# Altium schematic sheet Sensing.SchDoc: fNIRS - Sensing
size A3; CompanyName: UofT Capstone Team 2024991; DrawnBy: Tony Kim; Revision: 1; SheetNumber: 8; SheetTotal: 13
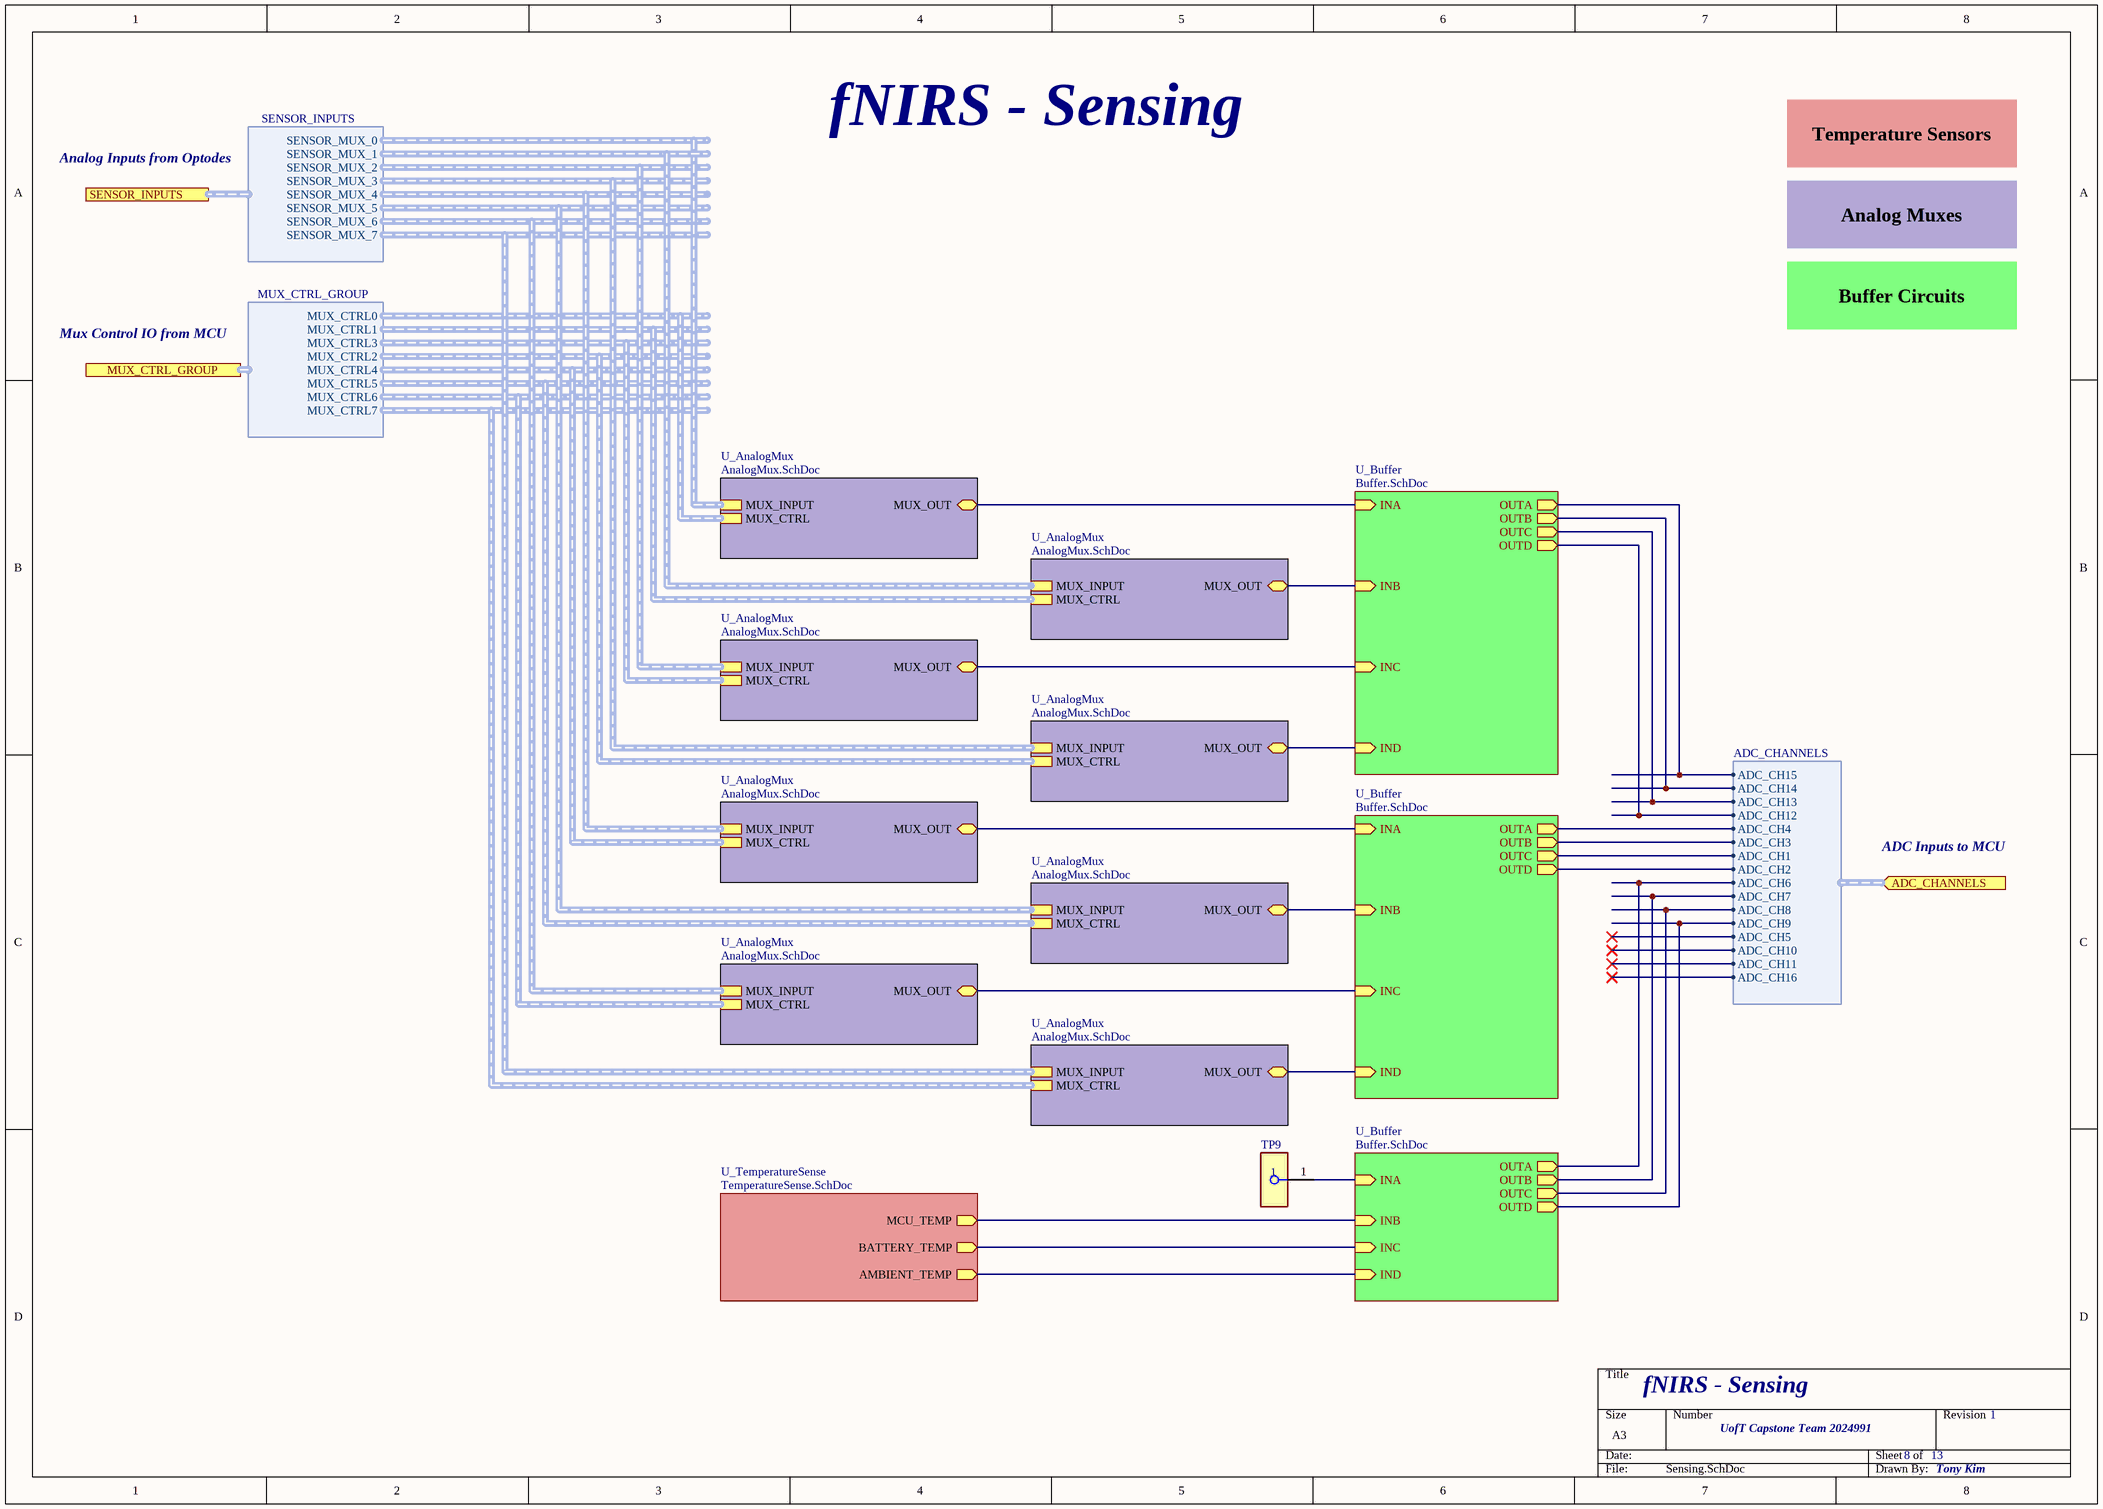
[diagram p0: Sensing.SchDoc]

## Parts
TP9  S2761-46R  [FP-S2761-46R-MFG]  (value not drawn)

## Sub-sheets
U_AnalogMux = AnalogMux.SchDoc: MUX_INPUT (harness SENSOR_INPUT), MUX_CTRL (harness MUX_CTRL), MUX_OUT (bidir)
U_AnalogMux = AnalogMux.SchDoc: MUX_INPUT (harness SENSOR_INPUT), MUX_CTRL (harness MUX_CTRL), MUX_OUT (bidir)
U_AnalogMux = AnalogMux.SchDoc: MUX_INPUT (harness SENSOR_INPUT), MUX_CTRL (harness MUX_CTRL), MUX_OUT (bidir)
U_AnalogMux = AnalogMux.SchDoc: MUX_INPUT (harness SENSOR_INPUT), MUX_CTRL (harness MUX_CTRL), MUX_OUT (bidir)
U_AnalogMux = AnalogMux.SchDoc: MUX_INPUT (harness SENSOR_INPUT), MUX_CTRL (harness MUX_CTRL), MUX_OUT (bidir)
U_AnalogMux = AnalogMux.SchDoc: MUX_INPUT (harness SENSOR_INPUT), MUX_CTRL (harness MUX_CTRL), MUX_OUT (bidir)
U_AnalogMux = AnalogMux.SchDoc: MUX_INPUT (harness SENSOR_INPUT), MUX_CTRL (harness MUX_CTRL), MUX_OUT (bidir)
U_AnalogMux = AnalogMux.SchDoc: MUX_INPUT (harness SENSOR_INPUT), MUX_CTRL (harness MUX_CTRL), MUX_OUT (bidir)
U_Buffer = Buffer.SchDoc: OUTA (out), OUTB (out), OUTC (out), OUTD (out), INA (in), INB (in), INC (in), IND (in)
U_Buffer = Buffer.SchDoc: OUTA (out), OUTB (out), OUTC (out), OUTD (out), INA (in), INB (in), INC (in), IND (in)
U_Buffer = Buffer.SchDoc: OUTA (out), OUTB (out), OUTC (out), OUTD (out), INA (in), INB (in), INC (in), IND (in)
U_TemperatureSense = TemperatureSense.SchDoc: MCU_TEMP (out), AMBIENT_TEMP (out), BATTERY_TEMP (out)

## Ports
ADC_CHANNELS (in, harness ADC_CHANNELS, see Top[2B], MCU[1C]), MUX_CTRL_GROUP (harness MUX_CTRL_GROUP, see Top[2B], MCU[8B]), SENSOR_INPUTS (harness SENSOR_INPUTS, see Top[3B], Connectors[1B])

## Harnesses
SENSOR_INPUTS: SENSOR_MUX_0, SENSOR_MUX_1, SENSOR_MUX_2, SENSOR_MUX_3, SENSOR_MUX_4, SENSOR_MUX_5, SENSOR_MUX_6, SENSOR_MUX_7
MUX_CTRL_GROUP: MUX_CTRL0, MUX_CTRL1, MUX_CTRL3, MUX_CTRL2, MUX_CTRL4, MUX_CTRL5, MUX_CTRL6, MUX_CTRL7
ADC_CHANNELS: ADC_CH1, ADC_CH2, ADC_CH3, ADC_CH4, ADC_CH5, ADC_CH6, ADC_CH7, ADC_CH8, ADC_CH9, ADC_CH10, ADC_CH11, ADC_CH12, ADC_CH13, ADC_CH14, ADC_CH15, ADC_CH16

## Nets
NetTP9_1: TP9.1 ; sheet U_Buffer/INA
(unnamed): sheet U_AnalogMux/MUX_OUT, sheet U_Buffer/INA
(unnamed): sheet U_AnalogMux/MUX_OUT, sheet U_Buffer/INC
(unnamed): sheet U_AnalogMux/MUX_OUT, sheet U_Buffer/INA
(unnamed): sheet U_AnalogMux/MUX_OUT, sheet U_Buffer/INC
(unnamed): sheet U_AnalogMux/MUX_OUT, sheet U_Buffer/INB
(unnamed): sheet U_AnalogMux/MUX_OUT, sheet U_Buffer/IND
(unnamed): sheet U_AnalogMux/MUX_OUT, sheet U_Buffer/INB
(unnamed): sheet U_AnalogMux/MUX_OUT, sheet U_Buffer/IND
(unnamed): sheet U_Buffer/OUTA, port ADC_CHANNELS.ADC_CH15
(unnamed): sheet U_Buffer/OUTB, port ADC_CHANNELS.ADC_CH14
(unnamed): sheet U_Buffer/OUTC, port ADC_CHANNELS.ADC_CH13
(unnamed): sheet U_Buffer/OUTD, port ADC_CHANNELS.ADC_CH12
(unnamed): sheet U_Buffer/OUTA, port ADC_CHANNELS.ADC_CH4
(unnamed): sheet U_Buffer/OUTB, port ADC_CHANNELS.ADC_CH3
(unnamed): sheet U_Buffer/OUTC, port ADC_CHANNELS.ADC_CH1
(unnamed): sheet U_Buffer/OUTD, port ADC_CHANNELS.ADC_CH2
(unnamed): sheet U_Buffer/OUTA, port ADC_CHANNELS.ADC_CH6
(unnamed): sheet U_Buffer/OUTB, port ADC_CHANNELS.ADC_CH7
(unnamed): sheet U_Buffer/OUTC, port ADC_CHANNELS.ADC_CH8
(unnamed): sheet U_Buffer/OUTD, port ADC_CHANNELS.ADC_CH9
(unnamed): sheet U_Buffer/INB, sheet U_TemperatureSense/MCU_TEMP
(unnamed): sheet U_Buffer/INC, sheet U_TemperatureSense/BATTERY_TEMP
(unnamed): sheet U_Buffer/IND, sheet U_TemperatureSense/AMBIENT_TEMP

## Notes on the sheet
- Analog Inputs from Optodes
- fNIRS - Sensing
- Temperature Sensors
- Analog Muxes
- Mux Control IO from MCU
- Buffer Circuits
- ADC Inputs to MCU

## Library data of the parts
TP9 = CMP-15817-000011-1: PC TEST POINT NATURAL; Body Material: Brass; Plating: Tin; Material: Copper Alloy; Mount: Surface Mount; Color: Natural; Packaging: Tape and Reel; RoHS Compliant: Yes